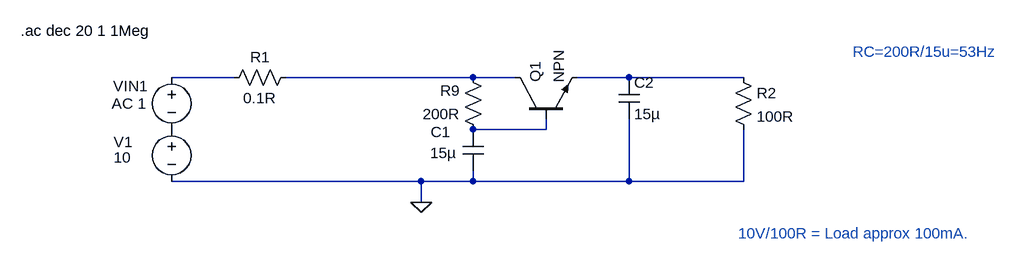
[diagram p0: schematic Draft01.asc]
Draft01.asc, the LTspice schematic file:
Version 4
SHEET 1 5720 1740
WIRE 1216 -256 1120 -256
WIRE 1584 -256 1296 -256
WIRE 1648 -256 1584 -256
WIRE 1824 -256 1744 -256
WIRE 2000 -256 1824 -256
WIRE 1696 -176 1696 -192
WIRE 1696 -176 1584 -176
WIRE 1504 -96 1120 -96
WIRE 1584 -96 1584 -112
WIRE 1584 -96 1504 -96
WIRE 1824 -96 1824 -192
WIRE 1824 -96 1584 -96
WIRE 2000 -96 2000 -176
WIRE 2000 -96 1824 -96
WIRE 1504 -64 1504 -96
FLAG 1504 -64 0
SYMBOL res 1312 -272 R90
WINDOW 0 0 56 VBottom 2
WINDOW 3 32 56 VTop 2
SYMATTR InstName R1
SYMATTR Value 0.1R
SYMBOL npn 1648 -192 R270
SYMATTR InstName Q1
SYMBOL res 1600 -160 R180
WINDOW 0 36 76 Left 2
WINDOW 3 36 40 Left 2
SYMATTR InstName R9
SYMATTR Value 200R
SYMBOL cap 1568 -176 R0
WINDOW 0 -49 4 Left 2
WINDOW 3 -50 36 Left 2
SYMATTR InstName C1
SYMATTR Value 15µ
SYMBOL cap 1808 -256 R0
SYMATTR InstName C2
SYMATTR Value 15µ
SYMBOL res 1984 -272 R0
SYMATTR InstName R2
SYMATTR Value 100R
SYMBOL voltage 1120 -192 R0
WINDOW 123 0 0 Left 0
WINDOW 39 0 0 Left 0
WINDOW 3 -89 59 Left 2
WINDOW 0 -89 35 Left 2
SYMATTR Value 10
SYMATTR InstName V1
SYMBOL voltage 1120 -272 R0
WINDOW 123 -92 56 Left 2
WINDOW 39 0 0 Left 0
WINDOW 3 -341 151 Left 2
WINDOW 0 -90 29 Left 2
SYMATTR Value2 AC 1
SYMATTR Value ""
SYMATTR InstName VIN1
TEXT 2168 -296 Left 2 ;RC=200R/15u=53Hz
TEXT 1992 -16 Left 2 ;10V/100R = Load approx 100mA.
TEXT 888 -328 Left 2 !.ac dec 20 1 1Meg

The netlist it stands for:
* Draft01.asc
R1 N002 N001 0.1R
Q1 N002 N004 N003 0 NPN
R9 N004 N002 200R
C1 N004 0 15µ
C2 N003 0 15µ
R2 N003 0 100R
V1 P001 0 10
VIN1 N001 P001 AC 1
.model NPN NPN
.model PNP PNP
.lib standard.bjt
* RC=200R/15u=53Hz
* 10V/100R = Load approx 100mA.
.ac dec 20 1 1Meg
.backanno
.end